# Altium schematic sheet 0245_GPU DECOUPLING_ VC.SchDoc
size 848 x 558 mm
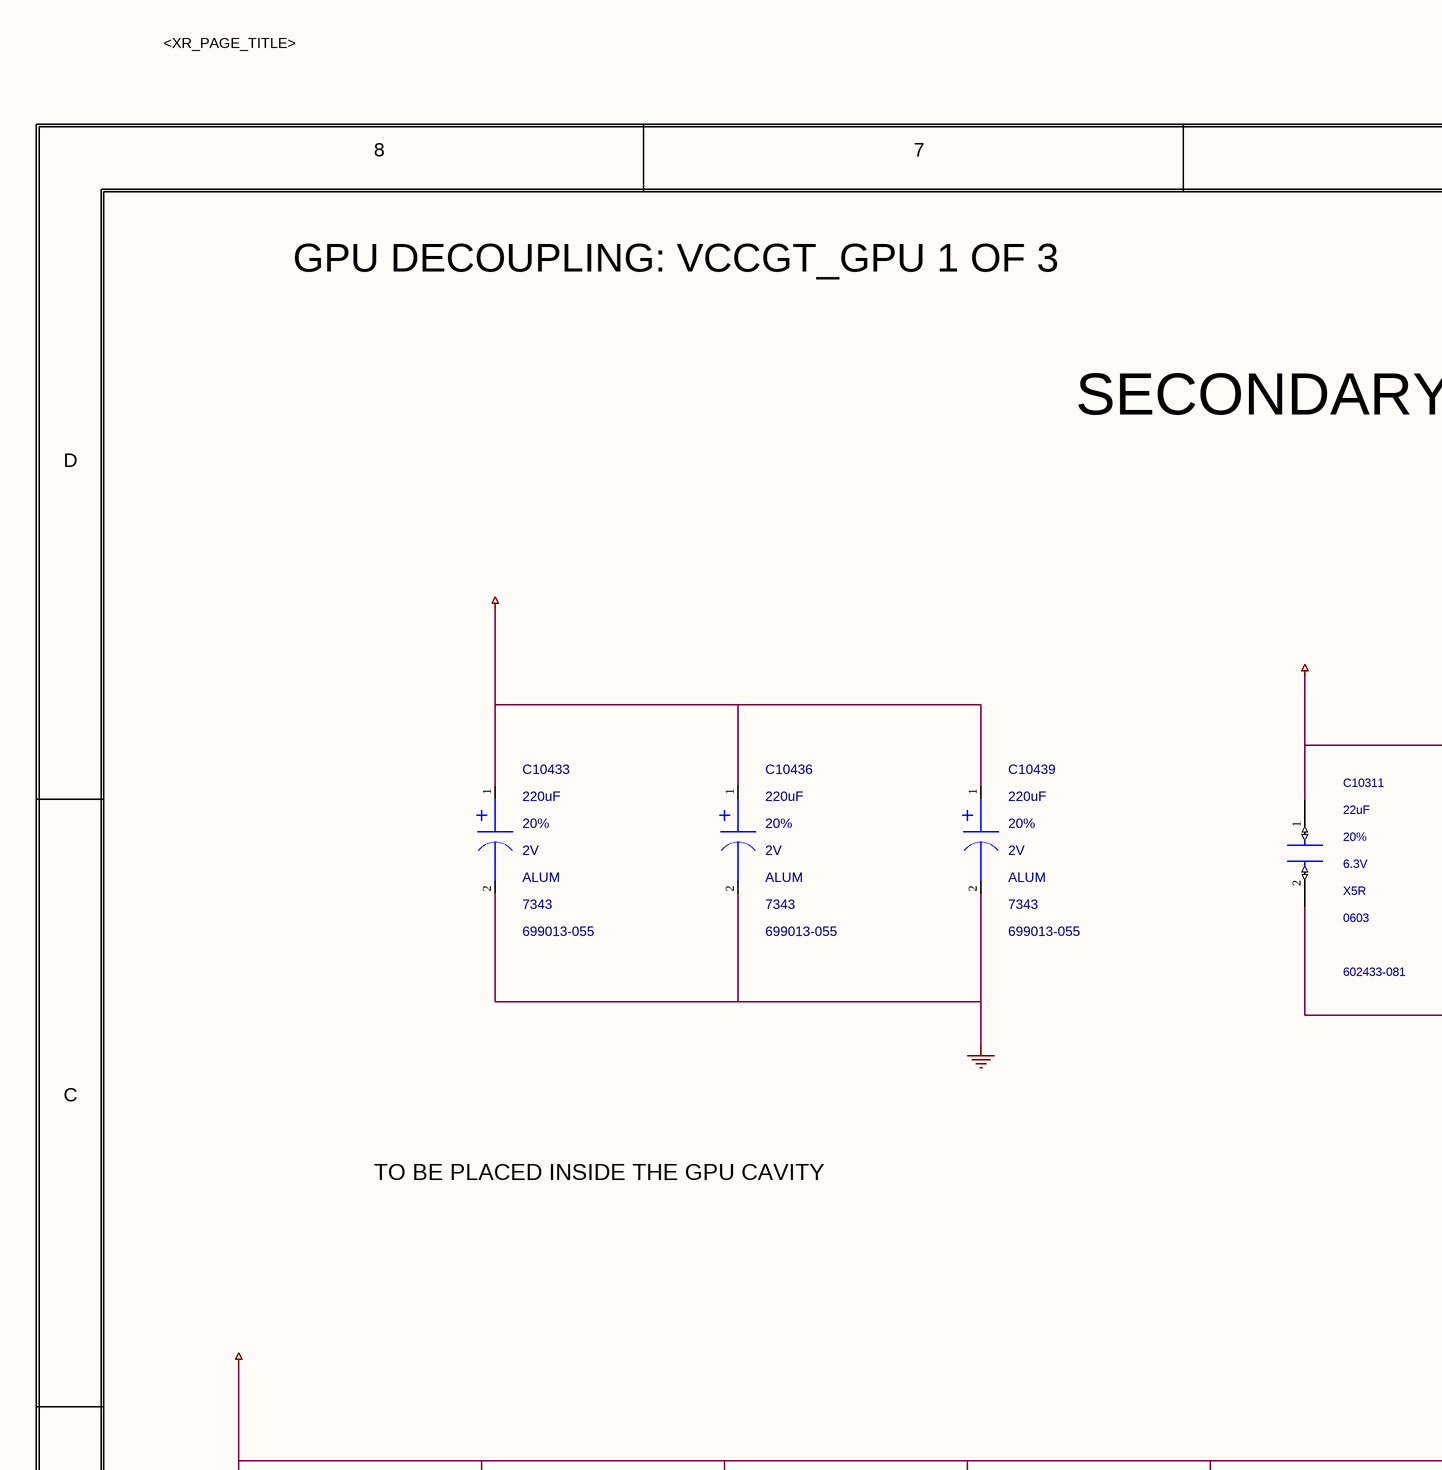
[diagram p0: 0245_GPU DECOUPLING_ VC.SchDoc, top left]
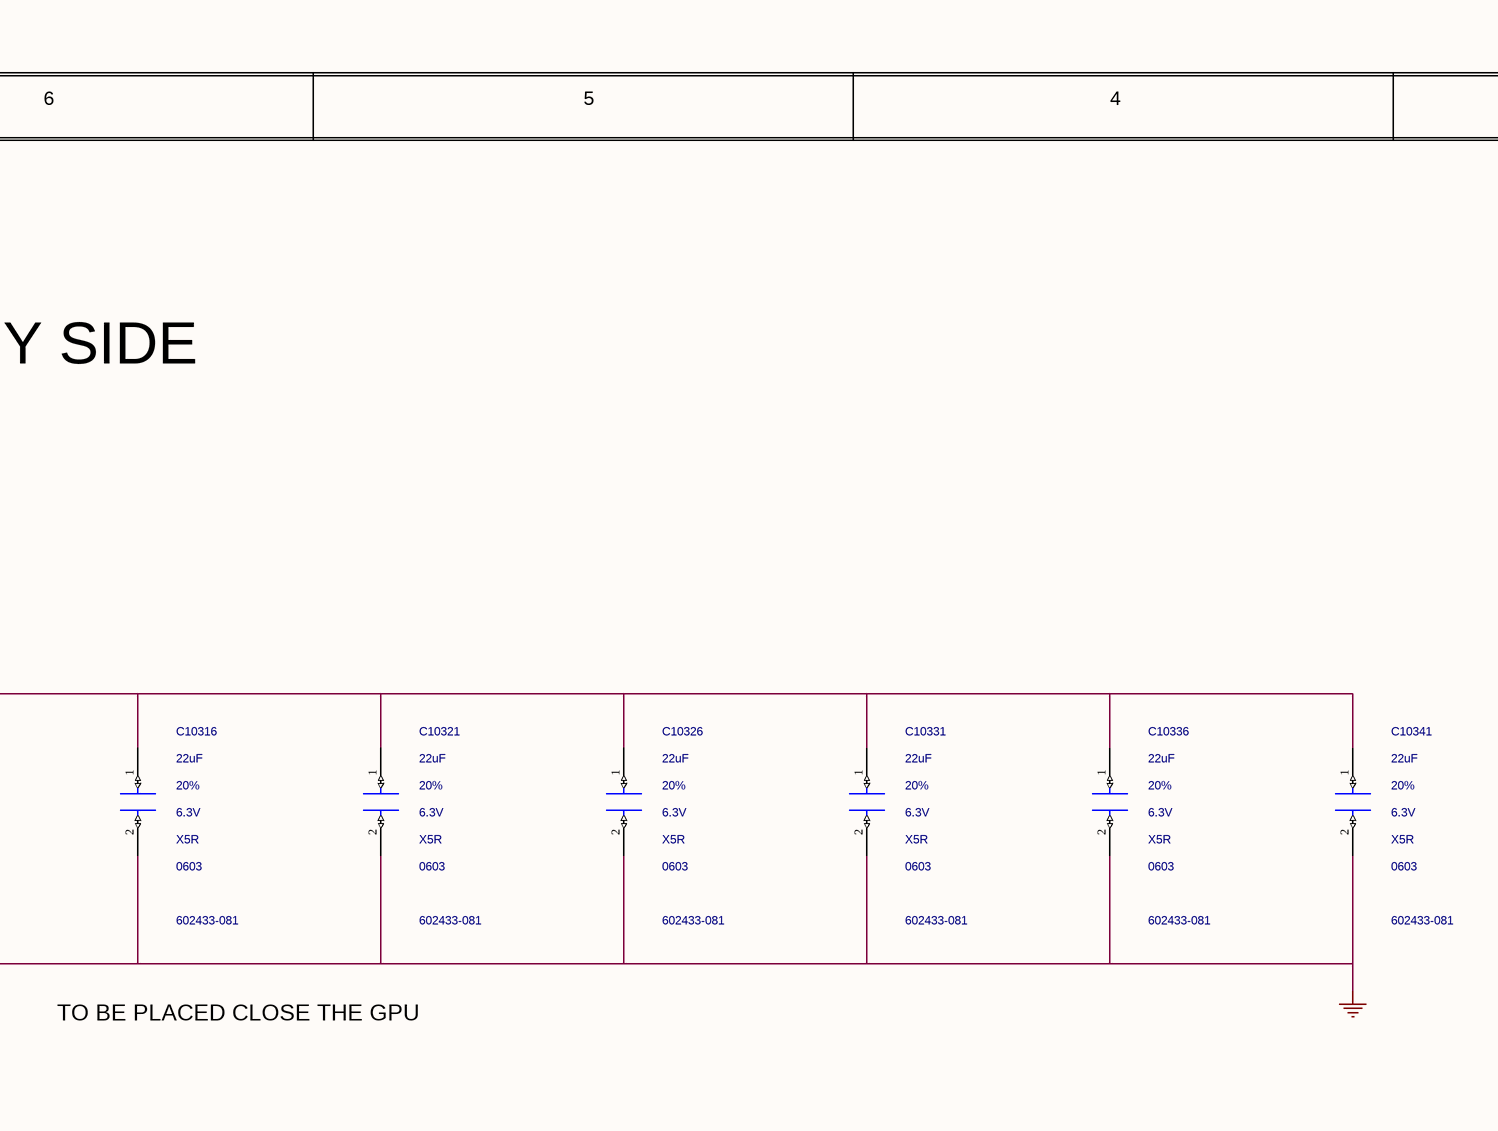
[diagram p1: 0245_GPU DECOUPLING_ VC.SchDoc, top middle]
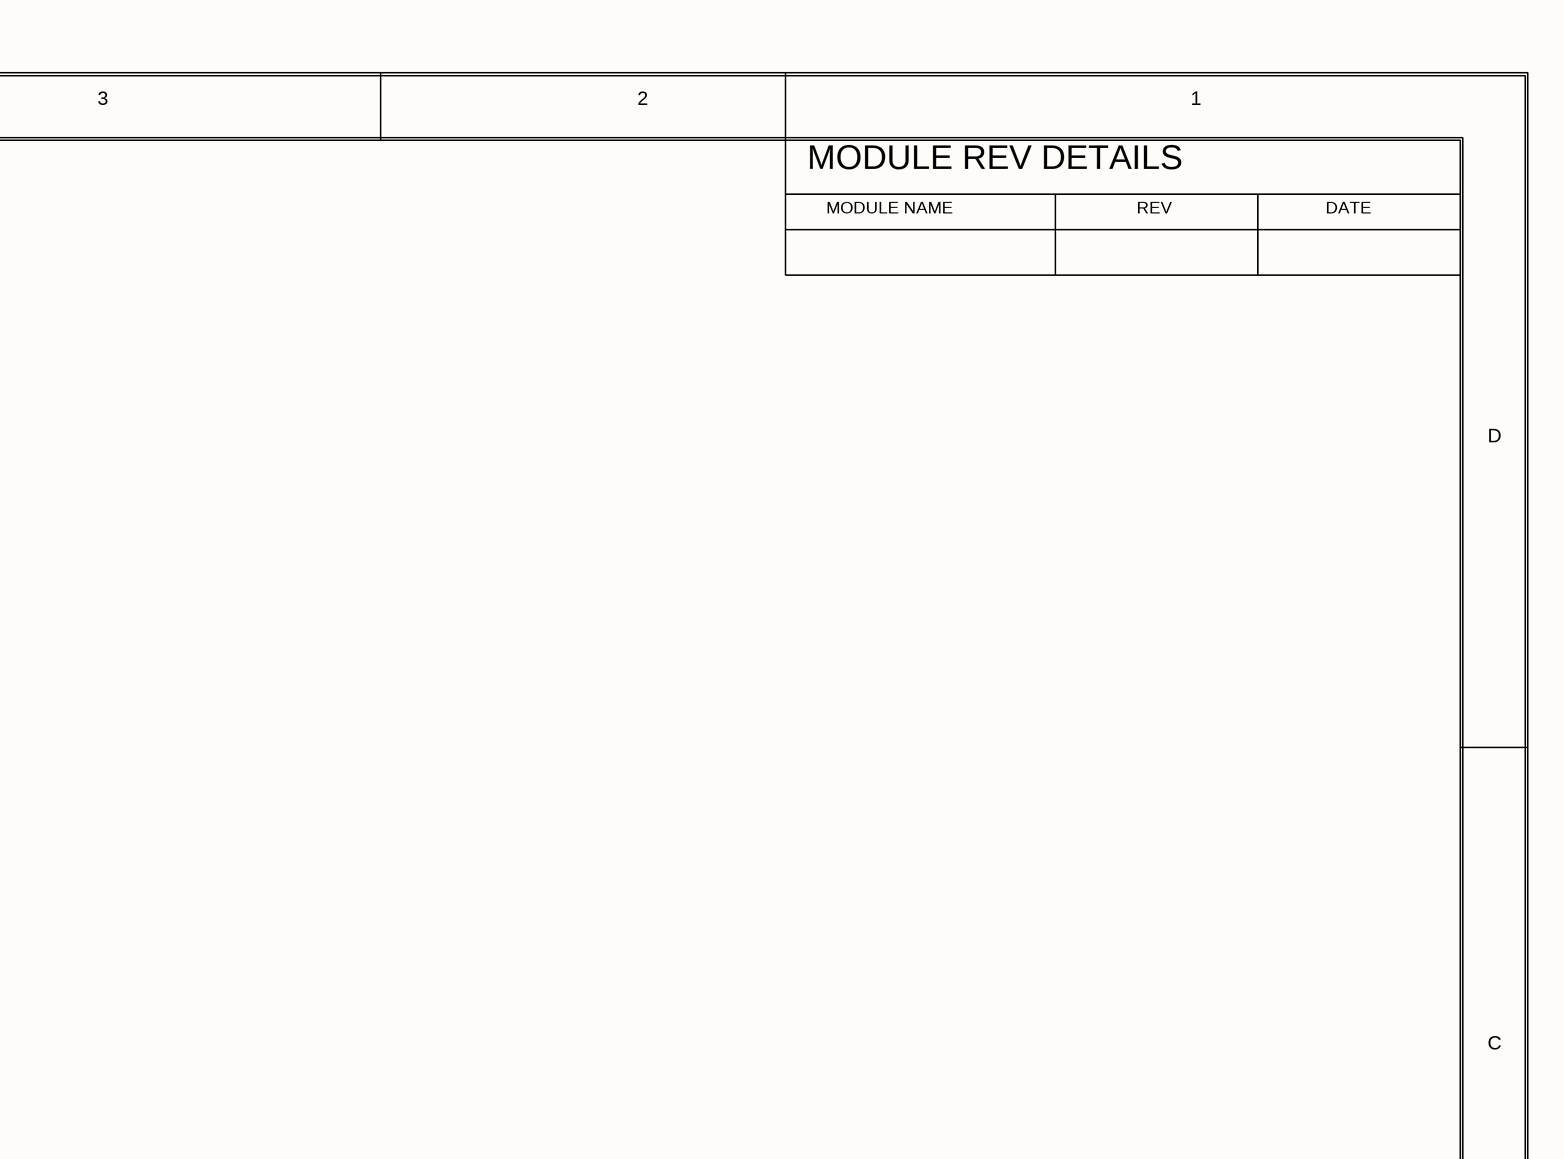
[diagram p2: 0245_GPU DECOUPLING_ VC.SchDoc, top right]
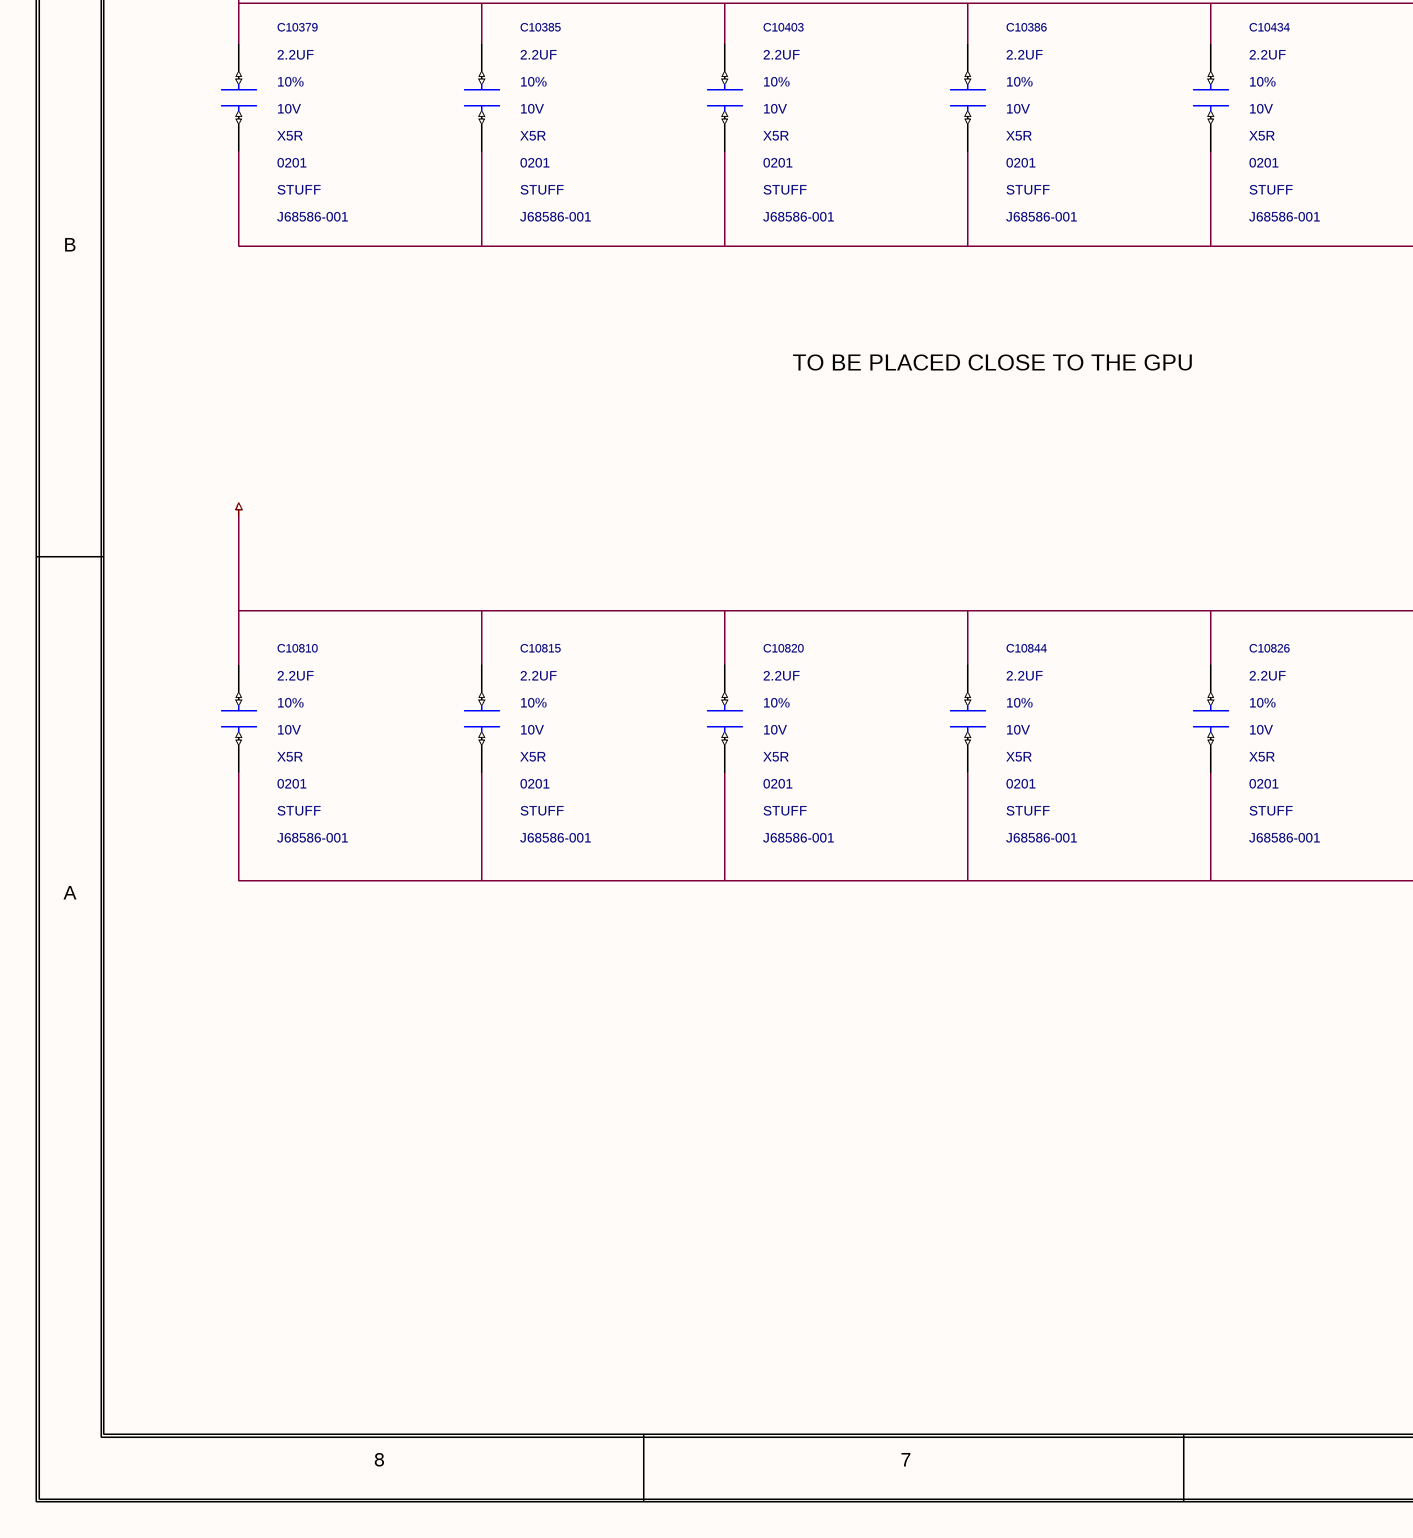
[diagram p3: 0245_GPU DECOUPLING_ VC.SchDoc, bottom left]
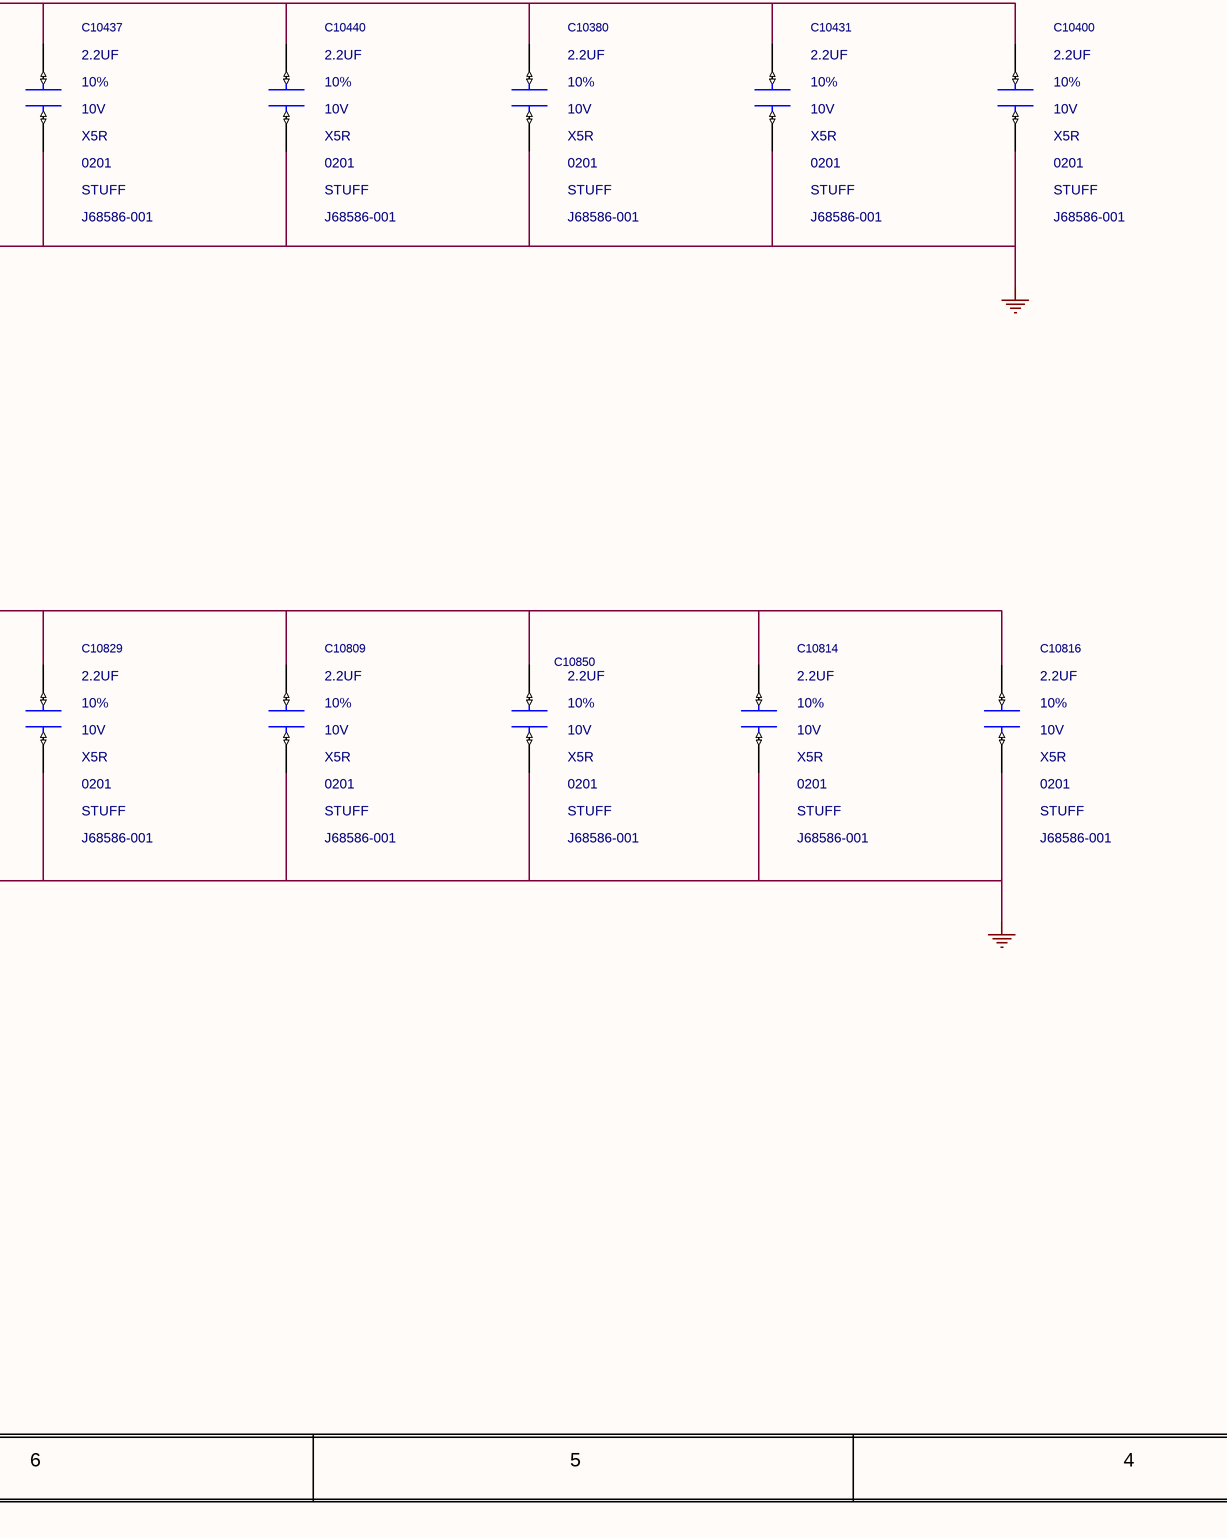
[diagram p4: 0245_GPU DECOUPLING_ VC.SchDoc, bottom middle]
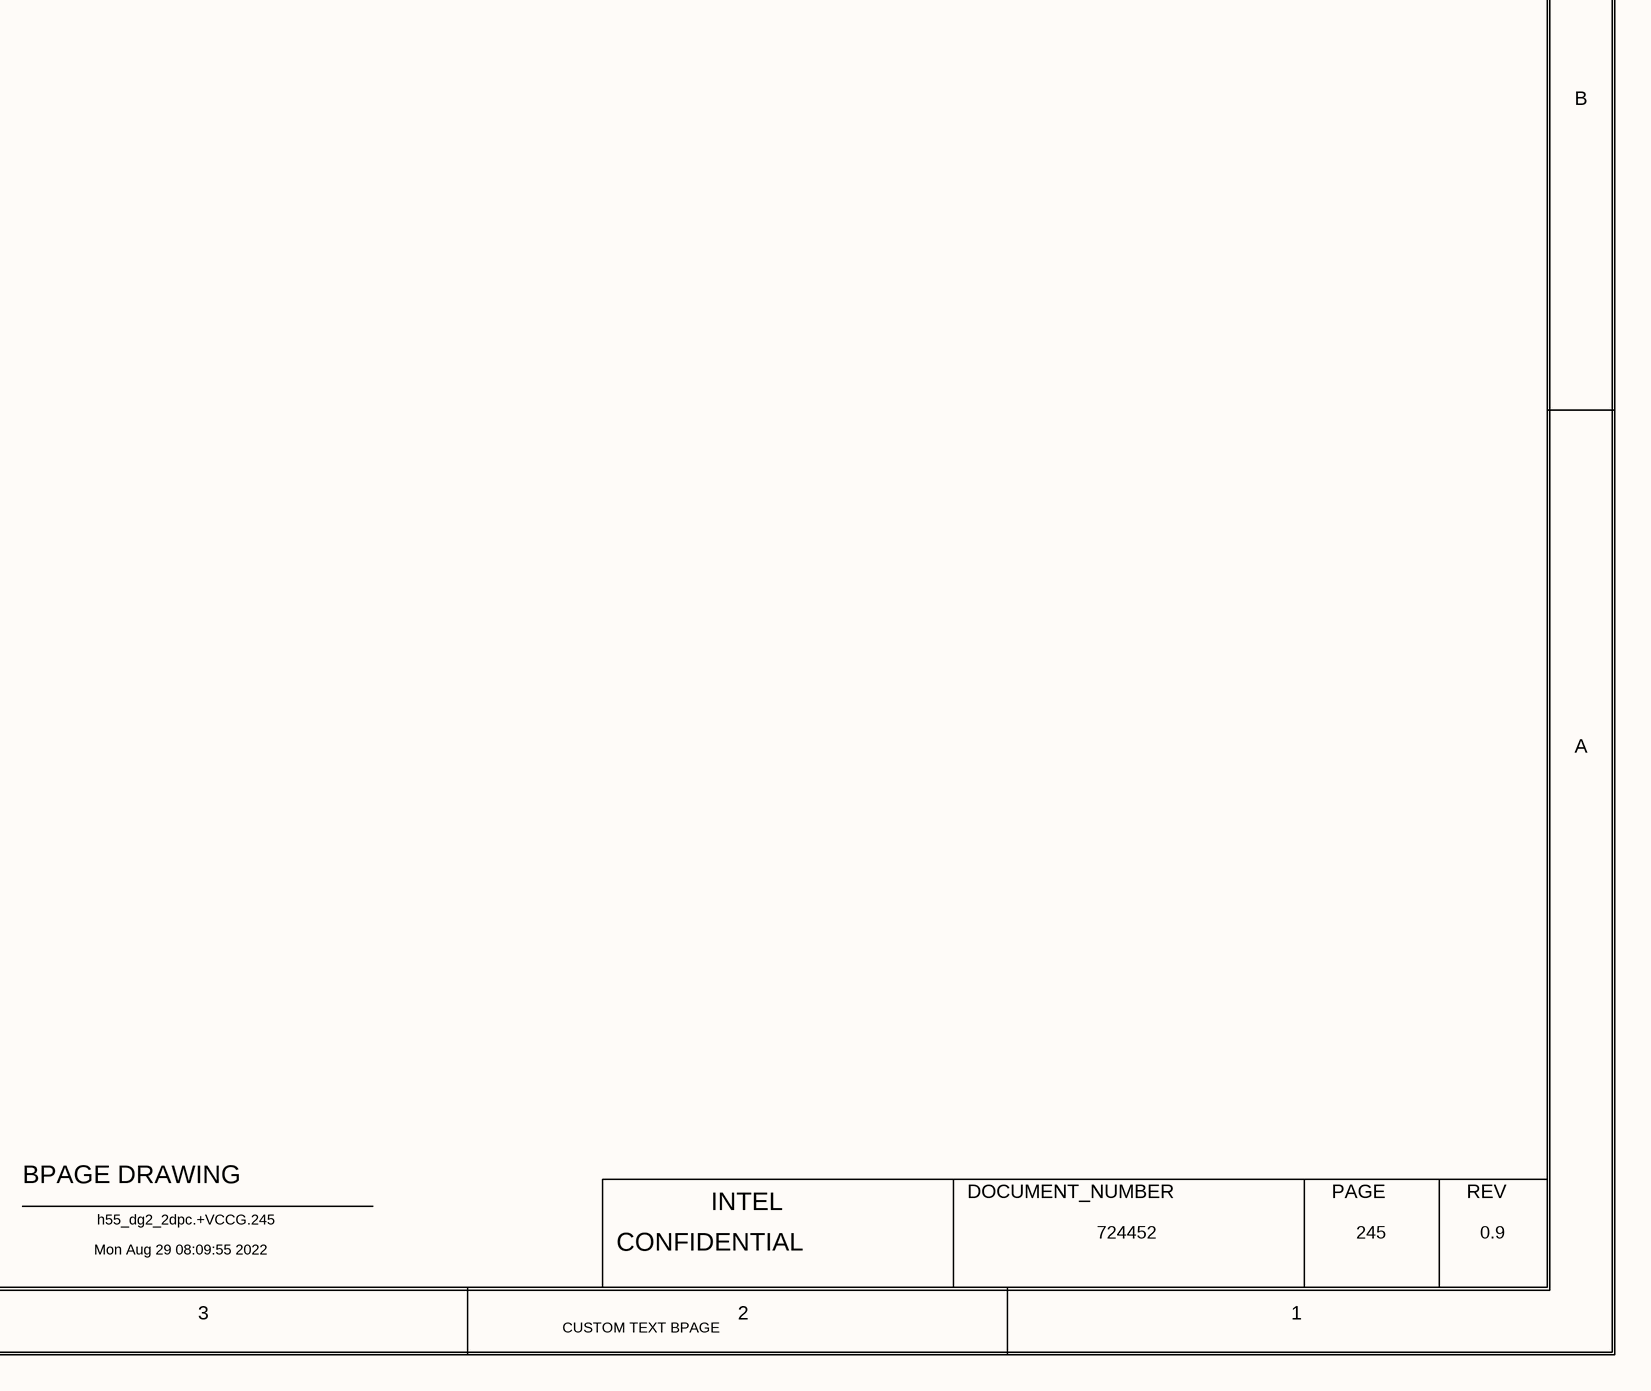
[diagram p5: 0245_GPU DECOUPLING_ VC.SchDoc, bottom right]

## Parts
C10311  22uF  MATERIAL: X5R  PACK_TYPE: 0603  PART_NUMBER: 602433-081  TOLERANCE: 20%  VOLTAGE: 6.3V  [SMC0603ID]
C10316  22uF  MATERIAL: X5R  PACK_TYPE: 0603  PART_NUMBER: 602433-081  TOLERANCE: 20%  VOLTAGE: 6.3V  [SMC0603ID]
C10321  22uF  MATERIAL: X5R  PACK_TYPE: 0603  PART_NUMBER: 602433-081  TOLERANCE: 20%  VOLTAGE: 6.3V  [SMC0603ID]
C10326  22uF  MATERIAL: X5R  PACK_TYPE: 0603  PART_NUMBER: 602433-081  TOLERANCE: 20%  VOLTAGE: 6.3V  [SMC0603ID]
C10331  22uF  MATERIAL: X5R  PACK_TYPE: 0603  PART_NUMBER: 602433-081  TOLERANCE: 20%  VOLTAGE: 6.3V  [SMC0603ID]
C10336  22uF  MATERIAL: X5R  PACK_TYPE: 0603  PART_NUMBER: 602433-081  TOLERANCE: 20%  VOLTAGE: 6.3V  [SMC0603ID]
C10341  22uF  MATERIAL: X5R  PACK_TYPE: 0603  PART_NUMBER: 602433-081  TOLERANCE: 20%  VOLTAGE: 6.3V  [SMC0603ID]
C10379  2.2UF  BOM_USE: STUFF  MATERIAL: X5R  PACK_TYPE: 0201  PART_NUMBER: J68586-001  TOLERANCE: 10%  VOLTAGE: 10V  [TK0_SM0201_690X390_MC]
C10380  2.2UF  BOM_USE: STUFF  MATERIAL: X5R  PACK_TYPE: 0201  PART_NUMBER: J68586-001  TOLERANCE: 10%  VOLTAGE: 10V  [TK0_SM0201_690X390_MC]
C10385  2.2UF  BOM_USE: STUFF  MATERIAL: X5R  PACK_TYPE: 0201  PART_NUMBER: J68586-001  TOLERANCE: 10%  VOLTAGE: 10V  [TK0_SM0201_690X390_MC]
C10386  2.2UF  BOM_USE: STUFF  MATERIAL: X5R  PACK_TYPE: 0201  PART_NUMBER: J68586-001  TOLERANCE: 10%  VOLTAGE: 10V  [TK0_SM0201_690X390_MC]
C10400  2.2UF  BOM_USE: STUFF  MATERIAL: X5R  PACK_TYPE: 0201  PART_NUMBER: J68586-001  TOLERANCE: 10%  VOLTAGE: 10V  [TK0_SM0201_690X390_MC]
C10403  2.2UF  BOM_USE: STUFF  MATERIAL: X5R  PACK_TYPE: 0201  PART_NUMBER: J68586-001  TOLERANCE: 10%  VOLTAGE: 10V  [TK0_SM0201_690X390_MC]
C10431  2.2UF  BOM_USE: STUFF  MATERIAL: X5R  PACK_TYPE: 0201  PART_NUMBER: J68586-001  TOLERANCE: 10%  VOLTAGE: 10V  [TK0_SM0201_690X390_MC]
C10433  220uF  MATERIAL: ALUM  PACK_TYPE: 7343  PART_NUMBER: 699013-055  TOLERANCE: 20%  VOLTAGE: 2V  [TK0_SMC7343_7500X4500_ALEL_MB]
C10434  2.2UF  BOM_USE: STUFF  MATERIAL: X5R  PACK_TYPE: 0201  PART_NUMBER: J68586-001  TOLERANCE: 10%  VOLTAGE: 10V  [TK0_SM0201_690X390_MC]
C10436  220uF  MATERIAL: ALUM  PACK_TYPE: 7343  PART_NUMBER: 699013-055  TOLERANCE: 20%  VOLTAGE: 2V  [TK0_SMC7343_7500X4500_ALEL_MB]
C10437  2.2UF  BOM_USE: STUFF  MATERIAL: X5R  PACK_TYPE: 0201  PART_NUMBER: J68586-001  TOLERANCE: 10%  VOLTAGE: 10V  [TK0_SM0201_690X390_MC]
C10439  220uF  MATERIAL: ALUM  PACK_TYPE: 7343  PART_NUMBER: 699013-055  TOLERANCE: 20%  VOLTAGE: 2V  [TK0_SMC7343_7500X4500_ALEL_MB]
C10440  2.2UF  BOM_USE: STUFF  MATERIAL: X5R  PACK_TYPE: 0201  PART_NUMBER: J68586-001  TOLERANCE: 10%  VOLTAGE: 10V  [TK0_SM0201_690X390_MC]
C10809  2.2UF  BOM_USE: STUFF  MATERIAL: X5R  PACK_TYPE: 0201  PART_NUMBER: J68586-001  TOLERANCE: 10%  VOLTAGE: 10V  [TK0_SM0201_690X390_MC]
C10810  2.2UF  BOM_USE: STUFF  MATERIAL: X5R  PACK_TYPE: 0201  PART_NUMBER: J68586-001  TOLERANCE: 10%  VOLTAGE: 10V  [TK0_SM0201_690X390_MC]
C10814  2.2UF  BOM_USE: STUFF  MATERIAL: X5R  PACK_TYPE: 0201  PART_NUMBER: J68586-001  TOLERANCE: 10%  VOLTAGE: 10V  [TK0_SM0201_690X390_MC]
C10815  2.2UF  BOM_USE: STUFF  MATERIAL: X5R  PACK_TYPE: 0201  PART_NUMBER: J68586-001  TOLERANCE: 10%  VOLTAGE: 10V  [TK0_SM0201_690X390_MC]
C10816  2.2UF  BOM_USE: STUFF  MATERIAL: X5R  PACK_TYPE: 0201  PART_NUMBER: J68586-001  TOLERANCE: 10%  VOLTAGE: 10V  [TK0_SM0201_690X390_MC]
C10820  2.2UF  BOM_USE: STUFF  MATERIAL: X5R  PACK_TYPE: 0201  PART_NUMBER: J68586-001  TOLERANCE: 10%  VOLTAGE: 10V  [TK0_SM0201_690X390_MC]
C10826  2.2UF  BOM_USE: STUFF  MATERIAL: X5R  PACK_TYPE: 0201  PART_NUMBER: J68586-001  TOLERANCE: 10%  VOLTAGE: 10V  [TK0_SM0201_690X390_MC]
C10829  2.2UF  BOM_USE: STUFF  MATERIAL: X5R  PACK_TYPE: 0201  PART_NUMBER: J68586-001  TOLERANCE: 10%  VOLTAGE: 10V  [TK0_SM0201_690X390_MC]
C10844  2.2UF  BOM_USE: STUFF  MATERIAL: X5R  PACK_TYPE: 0201  PART_NUMBER: J68586-001  TOLERANCE: 10%  VOLTAGE: 10V  [TK0_SM0201_690X390_MC]
C10850  2.2UF  BOM_USE: STUFF  MATERIAL: X5R  PACK_TYPE: 0201  PART_NUMBER: J68586-001  TOLERANCE: 10%  VOLTAGE: 10V  [TK0_SM0201_690X390_MC]

## Nets
+VCCGT_GPU: C10311.1(A) C10316.1(A) C10321.1(A) C10326.1(A) C10331.1(A) C10336.1(A) C10341.1(A) C10379.1(A) C10380.1(A) C10385.1(A) C10386.1(A) C10400.1(A) C10403.1(A) C10431.1(A) C10433.1(A) C10434.1(A) C10436.1(A) C10437.1(A) C10439.1(A) C10440.1(A) C10809.1(A) C10810.1(A) C10814.1(A) C10815.1(A) C10816.1(A) C10820.1(A) C10826.1(A) C10829.1(A) C10844.1(A) C10850.1(A)
GND: C10311.2(B) C10316.2(B) C10321.2(B) C10326.2(B) C10331.2(B) C10336.2(B) C10341.2(B) C10379.2(B) C10380.2(B) C10385.2(B) C10386.2(B) C10400.2(B) C10403.2(B) C10431.2(B) C10433.2(B) C10434.2(B) C10436.2(B) C10437.2(B) C10439.2(B) C10440.2(B) C10809.2(B) C10810.2(B) C10814.2(B) C10815.2(B) C10816.2(B) C10820.2(B) C10826.2(B) C10829.2(B) C10844.2(B) C10850.2(B)

## Notes on the sheet
- <XR_PAGE_TITLE>
- 8
- 7
- 6
- 5
- 4
- 3
- 2
- 1
- MODULE REV DETAILS
- GPU DECOUPLING: VCCGT_GPU 1 OF 3
- MODULE NAME
- REV
- DATE
- SECONDARY SIDE
- D
- C
- TO BE PLACED CLOSE THE GPU
- TO BE PLACED INSIDE THE GPU CAVITY
- B
- TO BE PLACED CLOSE TO THE GPU
- A
- BPAGE DRAWING
- INTEL
- DOCUMENT_NUMBER
- PAGE
- Mon Aug 29 08:09:55 2022
- h55_dg2_2dpc.+VCCG.245
- CONFIDENTIAL
- 724452
- 245
- 0.9
- CUSTOM TEXT BPAGE

## Library data of the parts
C10311 = CAP: CDS_PHYS_PART_NAME: CAP_0603-602433-081,X5R,22UF,6.3V,20%,LPDB,GENERIC; OriginalSymbolOrigin: (-50,25); XY: (-325,2300); VER: 1; ROT: 0; PHYS_PAGE: 245; LOCATION: C10311; DRAWING: @RVP1_ADL_SB_ADP_S_DDR5_SODIMM_2DPC_LIB.H55_DG2_2DPC(SCH_1):PAGE416; CDS_LIB: discrete; PCB Footprint: SMC0603ID; CHIPS_PART_NAME: CAP; CDS_PART_NAME: CAP_0603-602433-081,X5R,22UF,6.3V,20%,LPDB,GENERIC; CDS_LOCATION: C10311
C10316 = CAP: CDS_PHYS_PART_NAME: CAP_0603-602433-081,X5R,22UF,6.3V,20%,LPDB,GENERIC; OriginalSymbolOrigin: (-50,25); XY: (125,2300); VER: 1; ROT: 0; PHYS_PAGE: 245; LOCATION: C10316; DRAWING: @RVP1_ADL_SB_ADP_S_DDR5_SODIMM_2DPC_LIB.H55_DG2_2DPC(SCH_1):PAGE416; CDS_LIB: discrete; PCB Footprint: SMC0603ID; CHIPS_PART_NAME: CAP; CDS_PART_NAME: CAP_0603-602433-081,X5R,22UF,6.3V,20%,LPDB,GENERIC; CDS_LOCATION: C10316
C10321 = CAP: CDS_PHYS_PART_NAME: CAP_0603-602433-081,X5R,22UF,6.3V,20%,LPDB,GENERIC; OriginalSymbolOrigin: (-50,25); XY: (575,2300); VER: 1; ROT: 0; PHYS_PAGE: 245; LOCATION: C10321; DRAWING: @RVP1_ADL_SB_ADP_S_DDR5_SODIMM_2DPC_LIB.H55_DG2_2DPC(SCH_1):PAGE416; CDS_LIB: discrete; PCB Footprint: SMC0603ID; CHIPS_PART_NAME: CAP; CDS_PART_NAME: CAP_0603-602433-081,X5R,22UF,6.3V,20%,LPDB,GENERIC; CDS_LOCATION: C10321
C10326 = CAP: CDS_PHYS_PART_NAME: CAP_0603-602433-081,X5R,22UF,6.3V,20%,LPDB,GENERIC; OriginalSymbolOrigin: (-50,25); XY: (1025,2300); VER: 1; ROT: 0; PHYS_PAGE: 245; LOCATION: C10326; DRAWING: @RVP1_ADL_SB_ADP_S_DDR5_SODIMM_2DPC_LIB.H55_DG2_2DPC(SCH_1):PAGE416; CDS_LIB: discrete; PCB Footprint: SMC0603ID; CHIPS_PART_NAME: CAP; CDS_PART_NAME: CAP_0603-602433-081,X5R,22UF,6.3V,20%,LPDB,GENERIC; CDS_LOCATION: C10326
C10331 = CAP: CDS_PHYS_PART_NAME: CAP_0603-602433-081,X5R,22UF,6.3V,20%,LPDB,GENERIC; OriginalSymbolOrigin: (-50,25); XY: (1475,2300); VER: 1; ROT: 0; PHYS_PAGE: 245; LOCATION: C10331; DRAWING: @RVP1_ADL_SB_ADP_S_DDR5_SODIMM_2DPC_LIB.H55_DG2_2DPC(SCH_1):PAGE416; CDS_LIB: discrete; PCB Footprint: SMC0603ID; CHIPS_PART_NAME: CAP; CDS_PART_NAME: CAP_0603-602433-081,X5R,22UF,6.3V,20%,LPDB,GENERIC; CDS_LOCATION: C10331
C10336 = CAP: CDS_PHYS_PART_NAME: CAP_0603-602433-081,X5R,22UF,6.3V,20%,LPDB,GENERIC; OriginalSymbolOrigin: (-50,25); XY: (1925,2300); VER: 1; ROT: 0; PHYS_PAGE: 245; LOCATION: C10336; DRAWING: @RVP1_ADL_SB_ADP_S_DDR5_SODIMM_2DPC_LIB.H55_DG2_2DPC(SCH_1):PAGE416; CDS_LIB: discrete; PCB Footprint: SMC0603ID; CHIPS_PART_NAME: CAP; CDS_PART_NAME: CAP_0603-602433-081,X5R,22UF,6.3V,20%,LPDB,GENERIC; CDS_LOCATION: C10336
C10341 = CAP: CDS_PHYS_PART_NAME: CAP_0603-602433-081,X5R,22UF,6.3V,20%,LPDB,GENERIC; OriginalSymbolOrigin: (-50,25); XY: (2375,2300); VER: 1; ROT: 0; PHYS_PAGE: 245; LOCATION: C10341; DRAWING: @RVP1_ADL_SB_ADP_S_DDR5_SODIMM_2DPC_LIB.H55_DG2_2DPC(SCH_1):PAGE416; CDS_LIB: discrete; PCB Footprint: SMC0603ID; CHIPS_PART_NAME: CAP; CDS_PART_NAME: CAP_0603-602433-081,X5R,22UF,6.3V,20%,LPDB,GENERIC; CDS_LOCATION: C10341
C10379 = CAP_2: CDS_PHYS_PART_NAME: CAP_2_0201-J68586-001,X5R,2.2UF,10V,10%,TK0,GENERIC; CDS_LMAN_SYM_OUTLINE: -50,50,50,-50; FP_TECH: TK0; IP: GENERIC; ROOM: NONE; OriginalSymbolOrigin: (-50,25); XY: (-2300,1000); VER: 1; ROT: 0; PHYS_PAGE: 245; LOCATION: C10379; DRAWING: @RVP1_ADL_SB_ADP_S_DDR5_SODIMM_2DPC_LIB.H55_DG2_2DPC(SCH_1):PAGE416; CDS_LIB: discrete_2; VARIANT: ?; PCB Footprint: TK0_SM0201_690X390_MC; CHIPS_PART_NAME: CAP_2; CDS_PART_NAME: CAP_2_0201-J68586-001,X5R,2.2UF,10V,10%,TK0,GENERIC; CDS_LOCATION: C10379
C10380 = CAP_2: CDS_PHYS_PART_NAME: CAP_2_0201-J68586-001,X5R,2.2UF,10V,10%,TK0,GENERIC; CDS_LMAN_SYM_OUTLINE: -50,50,50,-50; FP_TECH: TK0; IP: GENERIC; ROOM: NONE; OriginalSymbolOrigin: (-50,25); XY: (850,1000); VER: 1; ROT: 0; PHYS_PAGE: 245; LOCATION: C10380; DRAWING: @RVP1_ADL_SB_ADP_S_DDR5_SODIMM_2DPC_LIB.H55_DG2_2DPC(SCH_1):PAGE416; CDS_LIB: discrete_2; VARIANT: ?; PCB Footprint: TK0_SM0201_690X390_MC; CHIPS_PART_NAME: CAP_2; CDS_PART_NAME: CAP_2_0201-J68586-001,X5R,2.2UF,10V,10%,TK0,GENERIC; CDS_LOCATION: C10380
C10385 = CAP_2: CDS_PHYS_PART_NAME: CAP_2_0201-J68586-001,X5R,2.2UF,10V,10%,TK0,GENERIC; CDS_LMAN_SYM_OUTLINE: -50,50,50,-50; FP_TECH: TK0; IP: GENERIC; ROOM: NONE; OriginalSymbolOrigin: (-50,25); XY: (-1850,1000); VER: 1; ROT: 0; PHYS_PAGE: 245; LOCATION: C10385; DRAWING: @RVP1_ADL_SB_ADP_S_DDR5_SODIMM_2DPC_LIB.H55_DG2_2DPC(SCH_1):PAGE416; CDS_LIB: discrete_2; VARIANT: ?; PCB Footprint: TK0_SM0201_690X390_MC; CHIPS_PART_NAME: CAP_2; CDS_PART_NAME: CAP_2_0201-J68586-001,X5R,2.2UF,10V,10%,TK0,GENERIC; CDS_LOCATION: C10385
C10386 = CAP_2: CDS_PHYS_PART_NAME: CAP_2_0201-J68586-001,X5R,2.2UF,10V,10%,TK0,GENERIC; CDS_LMAN_SYM_OUTLINE: -50,50,50,-50; FP_TECH: TK0; IP: GENERIC; ROOM: NONE; OriginalSymbolOrigin: (-50,25); XY: (-950,1000); VER: 1; ROT: 0; PHYS_PAGE: 245; LOCATION: C10386; DRAWING: @RVP1_ADL_SB_ADP_S_DDR5_SODIMM_2DPC_LIB.H55_DG2_2DPC(SCH_1):PAGE416; CDS_LIB: discrete_2; VARIANT: ?; PCB Footprint: TK0_SM0201_690X390_MC; CHIPS_PART_NAME: CAP_2; CDS_PART_NAME: CAP_2_0201-J68586-001,X5R,2.2UF,10V,10%,TK0,GENERIC; CDS_LOCATION: C10386
C10400 = CAP_2: CDS_PHYS_PART_NAME: CAP_2_0201-J68586-001,X5R,2.2UF,10V,10%,TK0,GENERIC; CDS_LMAN_SYM_OUTLINE: -50,50,50,-50; FP_TECH: TK0; IP: GENERIC; ROOM: NONE; OriginalSymbolOrigin: (-50,25); XY: (1750,1000); VER: 1; ROT: 0; PHYS_PAGE: 245; LOCATION: C10400; DRAWING: @RVP1_ADL_SB_ADP_S_DDR5_SODIMM_2DPC_LIB.H55_DG2_2DPC(SCH_1):PAGE416; CDS_LIB: discrete_2; VARIANT: ?; PCB Footprint: TK0_SM0201_690X390_MC; CHIPS_PART_NAME: CAP_2; CDS_PART_NAME: CAP_2_0201-J68586-001,X5R,2.2UF,10V,10%,TK0,GENERIC; CDS_LOCATION: C10400
C10403 = CAP_2: CDS_PHYS_PART_NAME: CAP_2_0201-J68586-001,X5R,2.2UF,10V,10%,TK0,GENERIC; CDS_LMAN_SYM_OUTLINE: -50,50,50,-50; FP_TECH: TK0; IP: GENERIC; ROOM: NONE; OriginalSymbolOrigin: (-50,25); XY: (-1400,1000); VER: 1; ROT: 0; PHYS_PAGE: 245; LOCATION: C10403; DRAWING: @RVP1_ADL_SB_ADP_S_DDR5_SODIMM_2DPC_LIB.H55_DG2_2DPC(SCH_1):PAGE416; CDS_LIB: discrete_2; VARIANT: ?; PCB Footprint: TK0_SM0201_690X390_MC; CHIPS_PART_NAME: CAP_2; CDS_PART_NAME: CAP_2_0201-J68586-001,X5R,2.2UF,10V,10%,TK0,GENERIC; CDS_LOCATION: C10403
C10431 = CAP_2: CDS_PHYS_PART_NAME: CAP_2_0201-J68586-001,X5R,2.2UF,10V,10%,TK0,GENERIC; CDS_LMAN_SYM_OUTLINE: -50,50,50,-50; FP_TECH: TK0; IP: GENERIC; ROOM: NONE; OriginalSymbolOrigin: (-50,25); XY: (1300,1000); VER: 1; ROT: 0; PHYS_PAGE: 245; LOCATION: C10431; DRAWING: @RVP1_ADL_SB_ADP_S_DDR5_SODIMM_2DPC_LIB.H55_DG2_2DPC(SCH_1):PAGE416; CDS_LIB: discrete_2; VARIANT: ?; PCB Footprint: TK0_SM0201_690X390_MC; CHIPS_PART_NAME: CAP_2; CDS_PART_NAME: CAP_2_0201-J68586-001,X5R,2.2UF,10V,10%,TK0,GENERIC; CDS_LOCATION: C10431
C10433 = CAPP_2: CDS_PHYS_PART_NAME: CAPP_2_7343-699013-055,ALUM,220UF,2V,20%,TK0,GENERIC; BOM_USE: STUFF; CDS_LMAN_SYM_OUTLINE: -50,100,50,-50; FP_TECH: TK0; IP: GENERIC; ROOM: NONE; OriginalSymbolOrigin: (-50,75); XY: (-1825,2325); VER: 1; ROT: 0; PHYS_PAGE: 245; LOCATION: C10433; DRAWING: @RVP1_ADL_SB_ADP_S_DDR5_SODIMM_2DPC_LIB.H55_DG2_2DPC(SCH_1):PAGE416; CDS_LIB: discrete_2; VARIANT: ?; PCB Footprint: TK0_SMC7343_7500X4500_ALEL_MB; CHIPS_PART_NAME: CAPP_2; CDS_PART_NAME: CAPP_2_7343-699013-055,ALUM,220UF,2V,20%,TK0,GENERIC; CDS_LOCATION: C10433
C10434 = CAP_2: CDS_PHYS_PART_NAME: CAP_2_0201-J68586-001,X5R,2.2UF,10V,10%,TK0,GENERIC; CDS_LMAN_SYM_OUTLINE: -50,50,50,-50; FP_TECH: TK0; IP: GENERIC; ROOM: NONE; OriginalSymbolOrigin: (-50,25); XY: (-500,1000); VER: 1; ROT: 0; PHYS_PAGE: 245; LOCATION: C10434; DRAWING: @RVP1_ADL_SB_ADP_S_DDR5_SODIMM_2DPC_LIB.H55_DG2_2DPC(SCH_1):PAGE416; CDS_LIB: discrete_2; VARIANT: ?; PCB Footprint: TK0_SM0201_690X390_MC; CHIPS_PART_NAME: CAP_2; CDS_PART_NAME: CAP_2_0201-J68586-001,X5R,2.2UF,10V,10%,TK0,GENERIC; CDS_LOCATION: C10434
C10436 = CAPP_2: CDS_PHYS_PART_NAME: CAPP_2_7343-699013-055,ALUM,220UF,2V,20%,TK0,GENERIC; BOM_USE: STUFF; CDS_LMAN_SYM_OUTLINE: -50,100,50,-50; FP_TECH: TK0; IP: GENERIC; ROOM: NONE; OriginalSymbolOrigin: (-50,75); XY: (-1375,2325); VER: 1; ROT: 0; PHYS_PAGE: 245; LOCATION: C10436; DRAWING: @RVP1_ADL_SB_ADP_S_DDR5_SODIMM_2DPC_LIB.H55_DG2_2DPC(SCH_1):PAGE416; CDS_LIB: discrete_2; VARIANT: ?; PCB Footprint: TK0_SMC7343_7500X4500_ALEL_MB; CHIPS_PART_NAME: CAPP_2; CDS_PART_NAME: CAPP_2_7343-699013-055,ALUM,220UF,2V,20%,TK0,GENERIC; CDS_LOCATION: C10436
C10437 = CAP_2: CDS_PHYS_PART_NAME: CAP_2_0201-J68586-001,X5R,2.2UF,10V,10%,TK0,GENERIC; CDS_LMAN_SYM_OUTLINE: -50,50,50,-50; FP_TECH: TK0; IP: GENERIC; ROOM: NONE; OriginalSymbolOrigin: (-50,25); XY: (-50,1000); VER: 1; ROT: 0; PHYS_PAGE: 245; LOCATION: C10437; DRAWING: @RVP1_ADL_SB_ADP_S_DDR5_SODIMM_2DPC_LIB.H55_DG2_2DPC(SCH_1):PAGE416; CDS_LIB: discrete_2; VARIANT: ?; PCB Footprint: TK0_SM0201_690X390_MC; CHIPS_PART_NAME: CAP_2; CDS_PART_NAME: CAP_2_0201-J68586-001,X5R,2.2UF,10V,10%,TK0,GENERIC; CDS_LOCATION: C10437
C10439 = CAPP_2: CDS_PHYS_PART_NAME: CAPP_2_7343-699013-055,ALUM,220UF,2V,20%,TK0,GENERIC; BOM_USE: STUFF; CDS_LMAN_SYM_OUTLINE: -50,100,50,-50; FP_TECH: TK0; IP: GENERIC; ROOM: NONE; OriginalSymbolOrigin: (-50,75); XY: (-925,2325); VER: 1; ROT: 0; PHYS_PAGE: 245; LOCATION: C10439; DRAWING: @RVP1_ADL_SB_ADP_S_DDR5_SODIMM_2DPC_LIB.H55_DG2_2DPC(SCH_1):PAGE416; CDS_LIB: discrete_2; VARIANT: ?; PCB Footprint: TK0_SMC7343_7500X4500_ALEL_MB; CHIPS_PART_NAME: CAPP_2; CDS_PART_NAME: CAPP_2_7343-699013-055,ALUM,220UF,2V,20%,TK0,GENERIC; CDS_LOCATION: C10439
C10440 = CAP_2: CDS_PHYS_PART_NAME: CAP_2_0201-J68586-001,X5R,2.2UF,10V,10%,TK0,GENERIC; CDS_LMAN_SYM_OUTLINE: -50,50,50,-50; FP_TECH: TK0; IP: GENERIC; ROOM: NONE; OriginalSymbolOrigin: (-50,25); XY: (400,1000); VER: 1; ROT: 0; PHYS_PAGE: 245; LOCATION: C10440; DRAWING: @RVP1_ADL_SB_ADP_S_DDR5_SODIMM_2DPC_LIB.H55_DG2_2DPC(SCH_1):PAGE416; CDS_LIB: discrete_2; VARIANT: ?; PCB Footprint: TK0_SM0201_690X390_MC; CHIPS_PART_NAME: CAP_2; CDS_PART_NAME: CAP_2_0201-J68586-001,X5R,2.2UF,10V,10%,TK0,GENERIC; CDS_LOCATION: C10440
C10809 = CAP_2: CDS_PHYS_PART_NAME: CAP_2_0201-J68586-001,X5R,2.2UF,10V,10%,TK0,GENERIC; CDS_LMAN_SYM_OUTLINE: -50,50,50,-50; FP_TECH: TK0; IP: GENERIC; ROOM: NONE; OriginalSymbolOrigin: (-50,25); XY: (400,-150); VER: 1; ROT: 0; PHYS_PAGE: 245; LOCATION: C10809; DRAWING: @RVP1_ADL_SB_ADP_S_DDR5_SODIMM_2DPC_LIB.H55_DG2_2DPC(SCH_1):PAGE416; CDS_LIB: discrete_2; VARIANT: ?; PCB Footprint: TK0_SM0201_690X390_MC; CHIPS_PART_NAME: CAP_2; CDS_PART_NAME: CAP_2_0201-J68586-001,X5R,2.2UF,10V,10%,TK0,GENERIC; CDS_LOCATION: C10809
C10810 = CAP_2: CDS_PHYS_PART_NAME: CAP_2_0201-J68586-001,X5R,2.2UF,10V,10%,TK0,GENERIC; CDS_LMAN_SYM_OUTLINE: -50,50,50,-50; FP_TECH: TK0; IP: GENERIC; ROOM: NONE; OriginalSymbolOrigin: (-50,25); XY: (-2300,-150); VER: 1; ROT: 0; PHYS_PAGE: 245; LOCATION: C10810; DRAWING: @RVP1_ADL_SB_ADP_S_DDR5_SODIMM_2DPC_LIB.H55_DG2_2DPC(SCH_1):PAGE416; CDS_LIB: discrete_2; VARIANT: ?; PCB Footprint: TK0_SM0201_690X390_MC; CHIPS_PART_NAME: CAP_2; CDS_PART_NAME: CAP_2_0201-J68586-001,X5R,2.2UF,10V,10%,TK0,GENERIC; CDS_LOCATION: C10810
C10814 = CAP_2: CDS_PHYS_PART_NAME: CAP_2_0201-J68586-001,X5R,2.2UF,10V,10%,TK0,GENERIC; CDS_LMAN_SYM_OUTLINE: -50,50,50,-50; FP_TECH: TK0; IP: GENERIC; ROOM: NONE; OriginalSymbolOrigin: (-50,25); XY: (1275,-150); VER: 1; ROT: 0; PHYS_PAGE: 245; LOCATION: C10814; DRAWING: @RVP1_ADL_SB_ADP_S_DDR5_SODIMM_2DPC_LIB.H55_DG2_2DPC(SCH_1):PAGE416; CDS_LIB: discrete_2; VARIANT: ?; PCB Footprint: TK0_SM0201_690X390_MC; CHIPS_PART_NAME: CAP_2; CDS_PART_NAME: CAP_2_0201-J68586-001,X5R,2.2UF,10V,10%,TK0,GENERIC; CDS_LOCATION: C10814
C10815 = CAP_2: CDS_PHYS_PART_NAME: CAP_2_0201-J68586-001,X5R,2.2UF,10V,10%,TK0,GENERIC; CDS_LMAN_SYM_OUTLINE: -50,50,50,-50; FP_TECH: TK0; IP: GENERIC; ROOM: NONE; OriginalSymbolOrigin: (-50,25); XY: (-1850,-150); VER: 1; ROT: 0; PHYS_PAGE: 245; LOCATION: C10815; DRAWING: @RVP1_ADL_SB_ADP_S_DDR5_SODIMM_2DPC_LIB.H55_DG2_2DPC(SCH_1):PAGE416; CDS_LIB: discrete_2; VARIANT: ?; PCB Footprint: TK0_SM0201_690X390_MC; CHIPS_PART_NAME: CAP_2; CDS_PART_NAME: CAP_2_0201-J68586-001,X5R,2.2UF,10V,10%,TK0,GENERIC; CDS_LOCATION: C10815
C10816 = CAP_2: CDS_PHYS_PART_NAME: CAP_2_0201-J68586-001,X5R,2.2UF,10V,10%,TK0,GENERIC; CDS_LMAN_SYM_OUTLINE: -50,50,50,-50; FP_TECH: TK0; IP: GENERIC; ROOM: NONE; OriginalSymbolOrigin: (-50,25); XY: (1725,-150); VER: 1; ROT: 0; PHYS_PAGE: 245; LOCATION: C10816; DRAWING: @RVP1_ADL_SB_ADP_S_DDR5_SODIMM_2DPC_LIB.H55_DG2_2DPC(SCH_1):PAGE416; CDS_LIB: discrete_2; VARIANT: ?; PCB Footprint: TK0_SM0201_690X390_MC; CHIPS_PART_NAME: CAP_2; CDS_PART_NAME: CAP_2_0201-J68586-001,X5R,2.2UF,10V,10%,TK0,GENERIC; CDS_LOCATION: C10816
C10820 = CAP_2: CDS_PHYS_PART_NAME: CAP_2_0201-J68586-001,X5R,2.2UF,10V,10%,TK0,GENERIC; CDS_LMAN_SYM_OUTLINE: -50,50,50,-50; FP_TECH: TK0; IP: GENERIC; ROOM: NONE; OriginalSymbolOrigin: (-50,25); XY: (-1400,-150); VER: 1; ROT: 0; PHYS_PAGE: 245; LOCATION: C10820; DRAWING: @RVP1_ADL_SB_ADP_S_DDR5_SODIMM_2DPC_LIB.H55_DG2_2DPC(SCH_1):PAGE416; CDS_LIB: discrete_2; VARIANT: ?; PCB Footprint: TK0_SM0201_690X390_MC; CHIPS_PART_NAME: CAP_2; CDS_PART_NAME: CAP_2_0201-J68586-001,X5R,2.2UF,10V,10%,TK0,GENERIC; CDS_LOCATION: C10820
C10826 = CAP_2: CDS_PHYS_PART_NAME: CAP_2_0201-J68586-001,X5R,2.2UF,10V,10%,TK0,GENERIC; CDS_LMAN_SYM_OUTLINE: -50,50,50,-50; FP_TECH: TK0; IP: GENERIC; ROOM: NONE; OriginalSymbolOrigin: (-50,25); XY: (-500,-150); VER: 1; ROT: 0; PHYS_PAGE: 245; LOCATION: C10826; DRAWING: @RVP1_ADL_SB_ADP_S_DDR5_SODIMM_2DPC_LIB.H55_DG2_2DPC(SCH_1):PAGE416; CDS_LIB: discrete_2; VARIANT: ?; PCB Footprint: TK0_SM0201_690X390_MC; CHIPS_PART_NAME: CAP_2; CDS_PART_NAME: CAP_2_0201-J68586-001,X5R,2.2UF,10V,10%,TK0,GENERIC; CDS_LOCATION: C10826
C10829 = CAP_2: CDS_PHYS_PART_NAME: CAP_2_0201-J68586-001,X5R,2.2UF,10V,10%,TK0,GENERIC; CDS_LMAN_SYM_OUTLINE: -50,50,50,-50; FP_TECH: TK0; IP: GENERIC; ROOM: NONE; OriginalSymbolOrigin: (-50,25); XY: (-50,-150); VER: 1; ROT: 0; PHYS_PAGE: 245; LOCATION: C10829; DRAWING: @RVP1_ADL_SB_ADP_S_DDR5_SODIMM_2DPC_LIB.H55_DG2_2DPC(SCH_1):PAGE416; CDS_LIB: discrete_2; VARIANT: ?; PCB Footprint: TK0_SM0201_690X390_MC; CHIPS_PART_NAME: CAP_2; CDS_PART_NAME: CAP_2_0201-J68586-001,X5R,2.2UF,10V,10%,TK0,GENERIC; CDS_LOCATION: C10829
C10844 = CAP_2: CDS_PHYS_PART_NAME: CAP_2_0201-J68586-001,X5R,2.2UF,10V,10%,TK0,GENERIC; CDS_LMAN_SYM_OUTLINE: -50,50,50,-50; FP_TECH: TK0; IP: GENERIC; ROOM: NONE; OriginalSymbolOrigin: (-50,25); XY: (-950,-150); VER: 1; ROT: 0; PHYS_PAGE: 245; LOCATION: C10844; DRAWING: @RVP1_ADL_SB_ADP_S_DDR5_SODIMM_2DPC_LIB.H55_DG2_2DPC(SCH_1):PAGE416; CDS_LIB: discrete_2; VARIANT: ?; PCB Footprint: TK0_SM0201_690X390_MC; CHIPS_PART_NAME: CAP_2; CDS_PART_NAME: CAP_2_0201-J68586-001,X5R,2.2UF,10V,10%,TK0,GENERIC; CDS_LOCATION: C10844
C10850 = CAP_2: CDS_PHYS_PART_NAME: CAP_2_0201-J68586-001,X5R,2.2UF,10V,10%,TK0,GENERIC; CDS_LMAN_SYM_OUTLINE: -50,50,50,-50; FP_TECH: TK0; IP: GENERIC; ROOM: NONE; OriginalSymbolOrigin: (-50,25); XY: (850,-150); VER: 1; ROT: 0; PHYS_PAGE: 245; LOCATION: C10850; DRAWING: @RVP1_ADL_SB_ADP_S_DDR5_SODIMM_2DPC_LIB.H55_DG2_2DPC(SCH_1):PAGE416; CDS_LIB: discrete_2; VARIANT: ?; PCB Footprint: TK0_SM0201_690X390_MC; CHIPS_PART_NAME: CAP_2; CDS_PART_NAME: CAP_2_0201-J68586-001,X5R,2.2UF,10V,10%,TK0,GENERIC; CDS_LOCATION: C10850